# EAGLE design USBPowerBoost_SMD_v0_1_4 (EAGLE 5.11)
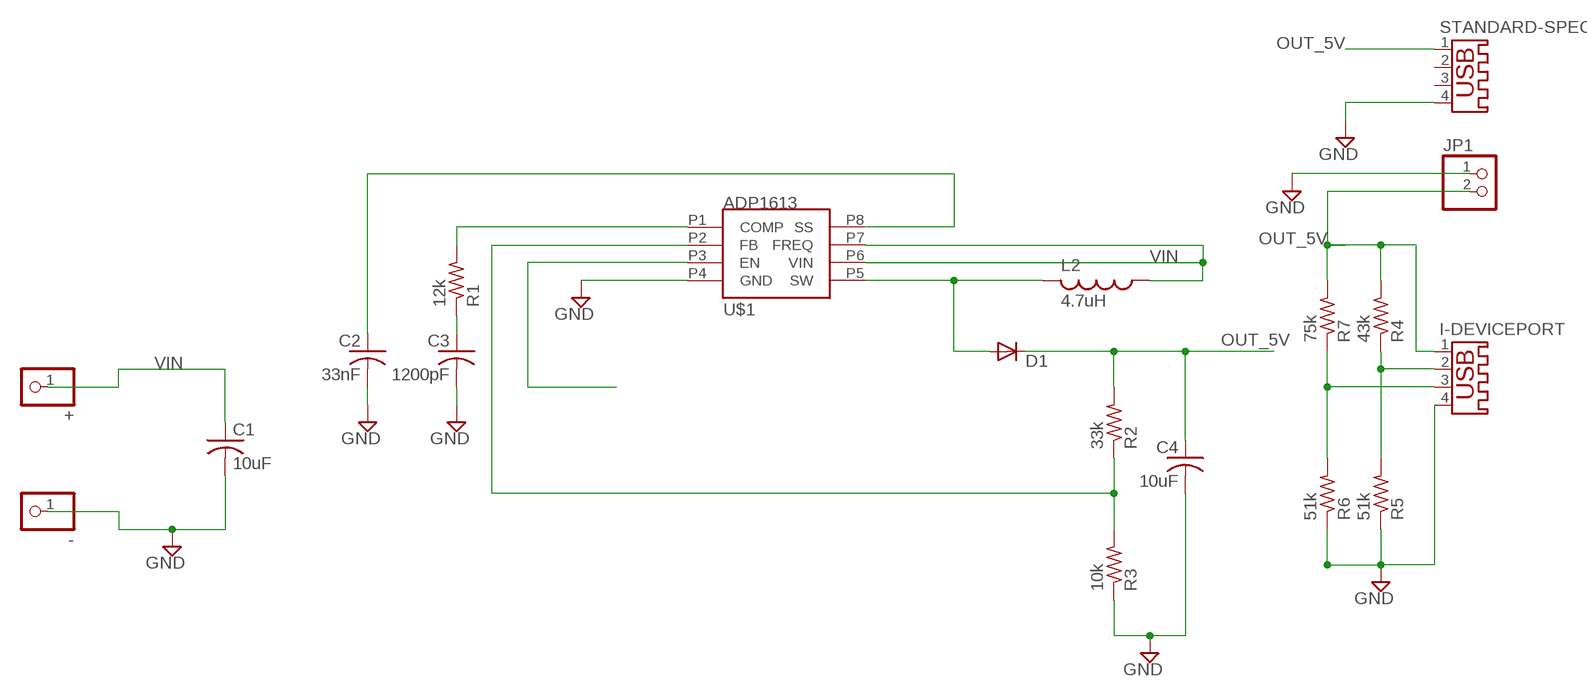
[diagram p0: schematic, sheet 1]

## Parts
+  PINHD-1X1  [1X01]
-  PINHD-1X1  [1X01]
C1  10uF  C-USC1206  [C1206]
C2  33nF  C-USC0603  [C0603]
C3  1200pF  C-USC0603  [C0603]
C4  10uF  C-USC1206  [C1206]
D1  DIODE-DO-214AC  [DO-214AC]
I-DEVICEPORT  USB-A003  [USB-A003]
JP1  HEADER-1X2  [1X02_OVAL]
L2  4.7uH  L-USL1812  [L1812]
R1  12k  R-US_R0603  [R0603]
R2  33k  R-US_R0603  [R0603]
R3  10k  R-US_R0603  [R0603]
R4  43k  R-US_R0603  [R0603]
R5  51k  R-US_R0603  [R0603]
R6  51k  R-US_R0603  [R0603]
R7  75k  R-US_R0603  [R0603]
STANDARD-SPEC  USB-A003  [USB-A003]
U$1  ADP1613  [RM-8]

## Nets
5V: D1.A L2.2 U$1.P5(SW)
GND: -.1 C1.2 C2.2 C3.2 C4.2 I-DEVICEPORT.4 JP1.1 R3.1 R5.1 R6.1 STANDARD-SPEC.4 U$1.P4(GND)
N$2: R2.1 R3.2 U$1.P2(FB)
N$3: I-DEVICEPORT.2 R4.1 R5.2
N$5: R1.2 U$1.P1(COMP)
N$7: C3.1 R1.1
N$11: C2.1 U$1.P8(SS)
N$15: I-DEVICEPORT.3 R6.2 R7.1
OUT_5V: C4.1 D1.C I-DEVICEPORT.1 JP1.2 R2.2 R4.2 R7.2 STANDARD-SPEC.1
VIN: +.1 C1.1 L2.1 U$1.P3(EN) U$1.P6(VIN) U$1.P7(FREQ)
Unconnected: STANDARD-SPEC.2 STANDARD-SPEC.3

## Library data of the parts
+ - = pinhead:PINHD-1X1: PIN HEADER
C1-C4 = rcl:C-US: CAPACITOR, American symbol
D1 = diode:DIODE-: DIODE
I-DEVICEPORT STANDARD-SPEC = con-yamaichi:USB-A003: USB connector; OC_FARNELL: unknown; OC_NEWARK: unknown
JP1 = microbuilder:HEADER-1X2: PIN HEADER
L2 = rcl:L-US: INDUCTOR, American symbol
R1-R7 = resistor:R-US_: RESISTOR, American symbol
U$1 = adp1613:ADP1613

## Board
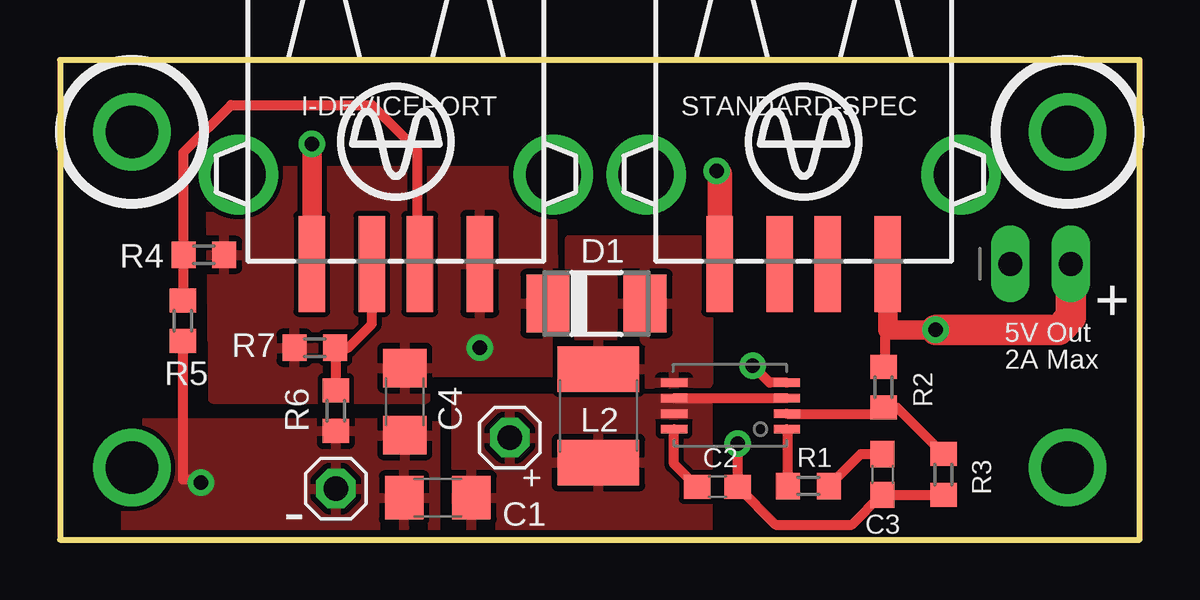
[diagram p1: board, top side]
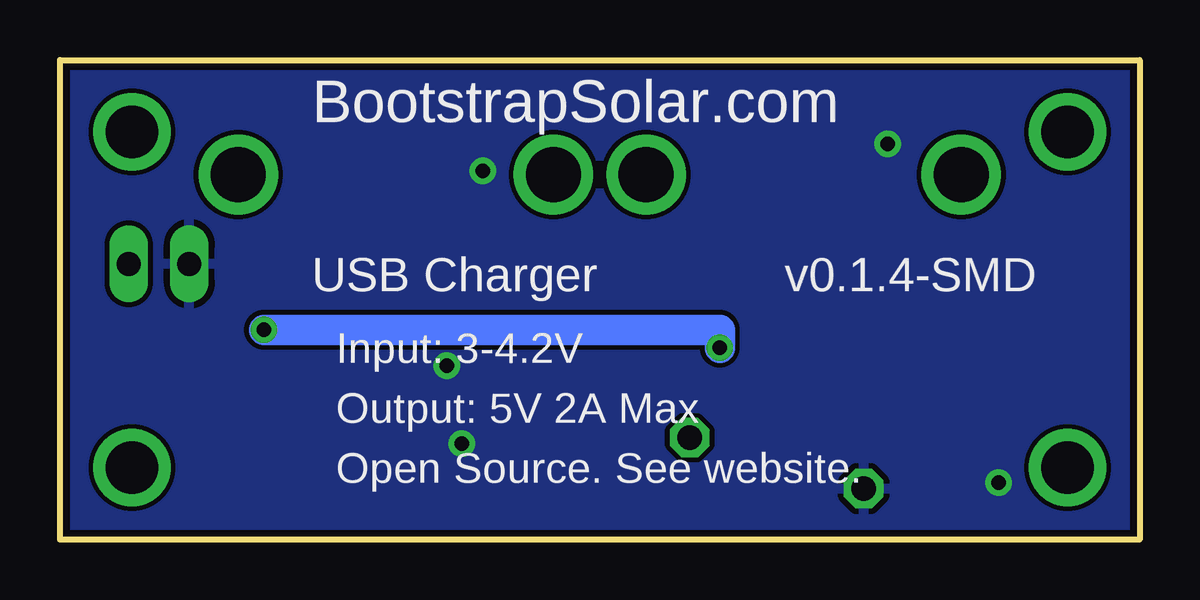
[diagram p2: board, bottom side, seen from below]

Size 45 x 20 mm. Coordinates in mm from the lower left corner, seen from the top.
Outline: 0,0 45,0 45,20 0,20 0,0
Copper layers (1*16): Top 0.035mm / dielectric 1.5mm / Bottom 0.035mm
Design rules "SparkFun *": minimum track width 8mil, minimum drill 20mil, track to track 8mil, track to pad 8mil, pad to pad 8mil, via to via 8mil, smd to smd 8mil, copper to edge 11mil, drill to drill 8mil, minimum pad ring 12mil, minimum via ring 10mil, stop-mask expansion 4mil, vias tented up to drill 25mil, thermal gap 10mil

### Footprints (pad centres in the part's own frame; a part is rotated, then mirrored left to right if it is on the bottom)
1X01 = drill 1.016 octagon: 1 0,0
C1206 = smd 1.6 x 1.8: 1 -1.4,0; 2 1.4,0
C0603 = smd 1.1 x 1: 1 -0.85,0; 2 0.85,0
DO-214AC = smd 1.8 x 2.4: A 2.025,0; C -2.025,0
USB-A003 = smd 1.12 x 4: 1 -3.5,14; 2 -1,14; 3 1,14; 4 3.5,14 | drill 2.3 round: P$1 -6.57,10.28; P$2 6.57,10.28
1X02_OVAL = drill 1 long: 1 -1.27,0; 2 1.27,0
L1812 = smd 1.9 x 3.4: 1 -1.95,0; 2 1.95,0
R0603 = smd 1 x 1.1: 1 -0.85,0; 2 0.85,0
RM-8 = smd 1.1 x 0.35: P1 -4.7,0.7; P2 -4.7,0.05; P3 -4.7,-0.6; P4 -4.7,-1.25; P5 0,-1.25; P6 0,-0.6; P7 0,0.05; P8 0,0.7

### Placement (x,y rotation side)
+  18.75,4.25 0 top
-  11.5,2.12 0 top
C1  15.75,1.75 180 top
C2  27.41,2.19 0 top
C3  34.29,2.71 270 top
C4  14.38,5.75 270 top
D1  22.36,9.84 0 top
I-DEVICEPORT  14,25.5 180 top
JP1  40.88,11.5 0 top
L2  22.45,5.16 90 top
R1  31.2,2.23 180 top
R2  34.33,6.35 90 top
R3  36.83,2.71 90 top
R4  6,11.88 0 top
R5  5.12,9.12 90 top
R6  11.5,5.38 90 top
R7  10.62,8 180 top
STANDARD-SPEC  31,25.5 180 top
U$1  25.6,5.3 180 top

### Tracks (layer width: path | path; a pad name or v marks a point on that pad's centre or on a via)
5V
  pour Top: 27,6.5 21.25,6.5 21.25,12.5 27,12.5
GND  (via drill 0.6)
  Top 0.406: R3.1 C3.2 34.24,1.86 33,0.62 29.82,0.62 C2.2 v28.25,4 | U$1.P4 29.57,6.55 v28.88,7.25 | R5.1 5.12,2.5 5.88,2.5 v5.88,2.38
  Top 0.813: I-DEVICEPORT.4 v10.5,16.5
  Top 1.016: STANDARD-SPEC.4 27.5,15.25 v27.38,15.38
  pour Bottom: -0.1,20.3 45,20.3 45,-0.2 -0.1,-0.2
  pour Top: 15.62,4.88 15.62,0 2.75,0 2.75,4.88
N$1  (via drill 2.2 pad 2.18)
  other vias: 3,17
N$2
  Top 0.406: R3.2 34.89,5.5 R2.1 34.33,5.25 U$1.P2
N$3
  Top 0.406: I-DEVICEPORT.2 14.88,11.62 14.88,16.25 13,18.12 7.12,18.12 5.15,16.15 R4.1 5.15,10 R5.2
N$4  (via drill 2.2)
  other vias: 3,3
N$5
  Top 0.406: R1.2 30.35,4.55 U$1.P1
N$6  (via drill 2.2 pad 2.18)
  other vias: 42,3
N$7
  Top 0.406: C3.1 33.38,3.56 R1.1
N$11
  Top 0.406: U$1.P8 25.6,3.15 C2.1
N$15
  Top 0.406: R6.2 11.5,7.97 R7.1 12,8 13,9 I-DEVICEPORT.3
N$20  (via drill 2.2 pad 2.18)
  other vias: 42,17
OUT_5V  (via drill 0.6)
  Top 0.406: R2.2 34.38,7.2 34.38,8.75 v36.5,8.75
  Top 0.813: v36.5,8.75 34.5,8.75 STANDARD-SPEC.1
  Top 1.27: JP1.2 42.15,9.27 41.62,8.75 v36.5,8.75
  Bottom 1.27: v36.5,8.75 17.5,8.75 v17.5,8
  pour Top: 20.5,15.38 6.25,15.38 6.38,5.88 15.25,5.88 15.25,7 20.62,7
VIN
  Top 0.406: U$1.P6 U$1.P3
  pour Top: 27,5.88 16.5,5.88 16.5,0 27,0
  pour Top (no thermals): 24.62,5.88 26.88,5.88 26.88,5.25 24.62,5.25

### Text on the board
bPlace: BootstrapSolar.com | v0.1.4-SMD | USB Charger | Input: 3-4.2V | Output: 5V 2A Max | Open Source. See website.
tNames: + | 5V Out | 2A Max